# EAGLE design Matrix_SMD (EAGLE 9.1.1)
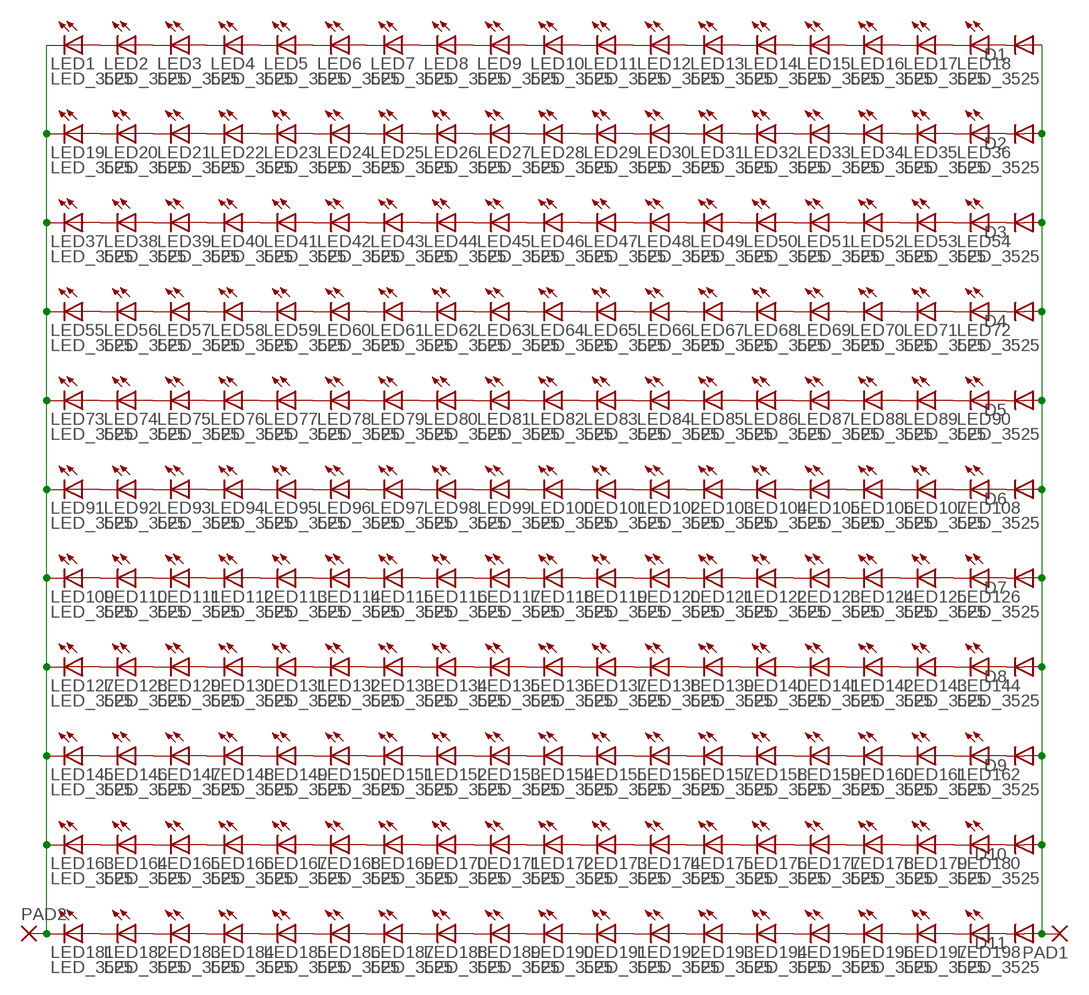
[diagram p0: schematic, sheet 1]

## Parts
D1  DIODE-SOD123  [SOD123]
D2  DIODE-SOD123  [SOD123]
D3  DIODE-SOD123  [SOD123]
D4  DIODE-SOD123  [SOD123]
D5  DIODE-SOD123  [SOD123]
D6  DIODE-SOD123  [SOD123]
D7  DIODE-SOD123  [SOD123]
D8  DIODE-SOD123  [SOD123]
D9  DIODE-SOD123  [SOD123]
D10  DIODE-SOD123  [SOD123]
D11  DIODE-SOD123  [SOD123]
LED1  LED_3525  [LED3528]
LED2  LED_3525  [LED3528]
LED3  LED_3525  [LED3528]
LED4  LED_3525  [LED3528]
LED5  LED_3525  [LED3528]
LED6  LED_3525  [LED3528]
LED7  LED_3525  [LED3528]
LED8  LED_3525  [LED3528]
LED9  LED_3525  [LED3528]
LED10  LED_3525  [LED3528]
LED11  LED_3525  [LED3528]
LED12  LED_3525  [LED3528]
LED13  LED_3525  [LED3528]
LED14  LED_3525  [LED3528]
LED15  LED_3525  [LED3528]
LED16  LED_3525  [LED3528]
LED17  LED_3525  [LED3528]
LED18  LED_3525  [LED3528]
LED19  LED_3525  [LED3528]
LED20  LED_3525  [LED3528]
LED21  LED_3525  [LED3528]
LED22  LED_3525  [LED3528]
LED23  LED_3525  [LED3528]
LED24  LED_3525  [LED3528]
LED25  LED_3525  [LED3528]
LED26  LED_3525  [LED3528]
LED27  LED_3525  [LED3528]
LED28  LED_3525  [LED3528]
LED29  LED_3525  [LED3528]
LED30  LED_3525  [LED3528]
LED31  LED_3525  [LED3528]
LED32  LED_3525  [LED3528]
LED33  LED_3525  [LED3528]
LED34  LED_3525  [LED3528]
LED35  LED_3525  [LED3528]
LED36  LED_3525  [LED3528]
LED37  LED_3525  [LED3528]
LED38  LED_3525  [LED3528]
LED39  LED_3525  [LED3528]
LED40  LED_3525  [LED3528]
LED41  LED_3525  [LED3528]
LED42  LED_3525  [LED3528]
LED43  LED_3525  [LED3528]
LED44  LED_3525  [LED3528]
LED45  LED_3525  [LED3528]
LED46  LED_3525  [LED3528]
LED47  LED_3525  [LED3528]
LED48  LED_3525  [LED3528]
LED49  LED_3525  [LED3528]
LED50  LED_3525  [LED3528]
LED51  LED_3525  [LED3528]
LED52  LED_3525  [LED3528]
LED53  LED_3525  [LED3528]
LED54  LED_3525  [LED3528]
LED55  LED_3525  [LED3528]
LED56  LED_3525  [LED3528]
LED57  LED_3525  [LED3528]
LED58  LED_3525  [LED3528]
LED59  LED_3525  [LED3528]
LED60  LED_3525  [LED3528]
LED61  LED_3525  [LED3528]
LED62  LED_3525  [LED3528]
LED63  LED_3525  [LED3528]
LED64  LED_3525  [LED3528]
LED65  LED_3525  [LED3528]
LED66  LED_3525  [LED3528]
LED67  LED_3525  [LED3528]
LED68  LED_3525  [LED3528]
LED69  LED_3525  [LED3528]
LED70  LED_3525  [LED3528]
LED71  LED_3525  [LED3528]
LED72  LED_3525  [LED3528]
LED73  LED_3525  [LED3528]
LED74  LED_3525  [LED3528]
LED75  LED_3525  [LED3528]
LED76  LED_3525  [LED3528]
LED77  LED_3525  [LED3528]
LED78  LED_3525  [LED3528]
LED79  LED_3525  [LED3528]
LED80  LED_3525  [LED3528]
LED81  LED_3525  [LED3528]
LED82  LED_3525  [LED3528]
LED83  LED_3525  [LED3528]
LED84  LED_3525  [LED3528]
LED85  LED_3525  [LED3528]
LED86  LED_3525  [LED3528]
LED87  LED_3525  [LED3528]
LED88  LED_3525  [LED3528]
LED89  LED_3525  [LED3528]
LED90  LED_3525  [LED3528]
LED91  LED_3525  [LED3528]
LED92  LED_3525  [LED3528]
LED93  LED_3525  [LED3528]
LED94  LED_3525  [LED3528]
LED95  LED_3525  [LED3528]
LED96  LED_3525  [LED3528]
LED97  LED_3525  [LED3528]
LED98  LED_3525  [LED3528]
LED99  LED_3525  [LED3528]
LED100  LED_3525  [LED3528]
LED101  LED_3525  [LED3528]
LED102  LED_3525  [LED3528]
LED103  LED_3525  [LED3528]
LED104  LED_3525  [LED3528]
LED105  LED_3525  [LED3528]
LED106  LED_3525  [LED3528]
LED107  LED_3525  [LED3528]
LED108  LED_3525  [LED3528]
LED109  LED_3525  [LED3528]
LED110  LED_3525  [LED3528]
LED111  LED_3525  [LED3528]
LED112  LED_3525  [LED3528]
LED113  LED_3525  [LED3528]
LED114  LED_3525  [LED3528]
LED115  LED_3525  [LED3528]
LED116  LED_3525  [LED3528]
LED117  LED_3525  [LED3528]
LED118  LED_3525  [LED3528]
LED119  LED_3525  [LED3528]
LED120  LED_3525  [LED3528]
LED121  LED_3525  [LED3528]
LED122  LED_3525  [LED3528]
LED123  LED_3525  [LED3528]
LED124  LED_3525  [LED3528]
LED125  LED_3525  [LED3528]
LED126  LED_3525  [LED3528]
LED127  LED_3525  [LED3528]
LED128  LED_3525  [LED3528]
LED129  LED_3525  [LED3528]
LED130  LED_3525  [LED3528]
LED131  LED_3525  [LED3528]
LED132  LED_3525  [LED3528]
LED133  LED_3525  [LED3528]
LED134  LED_3525  [LED3528]
LED135  LED_3525  [LED3528]
LED136  LED_3525  [LED3528]
LED137  LED_3525  [LED3528]
LED138  LED_3525  [LED3528]
LED139  LED_3525  [LED3528]
LED140  LED_3525  [LED3528]
LED141  LED_3525  [LED3528]
LED142  LED_3525  [LED3528]
LED143  LED_3525  [LED3528]
LED144  LED_3525  [LED3528]
LED145  LED_3525  [LED3528]
LED146  LED_3525  [LED3528]
LED147  LED_3525  [LED3528]
LED148  LED_3525  [LED3528]
LED149  LED_3525  [LED3528]
LED150  LED_3525  [LED3528]
LED151  LED_3525  [LED3528]
LED152  LED_3525  [LED3528]
LED153  LED_3525  [LED3528]
LED154  LED_3525  [LED3528]
LED155  LED_3525  [LED3528]
LED156  LED_3525  [LED3528]
LED157  LED_3525  [LED3528]
LED158  LED_3525  [LED3528]
LED159  LED_3525  [LED3528]
LED160  LED_3525  [LED3528]
LED161  LED_3525  [LED3528]
LED162  LED_3525  [LED3528]
LED163  LED_3525  [LED3528]
LED164  LED_3525  [LED3528]
LED165  LED_3525  [LED3528]
LED166  LED_3525  [LED3528]
LED167  LED_3525  [LED3528]
LED168  LED_3525  [LED3528]
LED169  LED_3525  [LED3528]
LED170  LED_3525  [LED3528]
LED171  LED_3525  [LED3528]
LED172  LED_3525  [LED3528]
LED173  LED_3525  [LED3528]
LED174  LED_3525  [LED3528]
LED175  LED_3525  [LED3528]
LED176  LED_3525  [LED3528]
LED177  LED_3525  [LED3528]
LED178  LED_3525  [LED3528]
LED179  LED_3525  [LED3528]
LED180  LED_3525  [LED3528]
LED181  LED_3525  [LED3528]
LED182  LED_3525  [LED3528]
LED183  LED_3525  [LED3528]
LED184  LED_3525  [LED3528]
LED185  LED_3525  [LED3528]
LED186  LED_3525  [LED3528]
LED187  LED_3525  [LED3528]
LED188  LED_3525  [LED3528]
LED189  LED_3525  [LED3528]
LED190  LED_3525  [LED3528]
LED191  LED_3525  [LED3528]
LED192  LED_3525  [LED3528]
LED193  LED_3525  [LED3528]
LED194  LED_3525  [LED3528]
LED195  LED_3525  [LED3528]
LED196  LED_3525  [LED3528]
LED197  LED_3525  [LED3528]
LED198  LED_3525  [LED3528]
PAD1  3,81/1,4  [3,81/1,4]
PAD2  3,81/1,4  [3,81/1,4]

## Nets
N$1: LED1.A LED2.C
N$2: LED2.A LED3.C
N$3: LED3.A LED4.C
N$4: LED4.A LED5.C
N$5: LED5.A LED6.C
N$6: LED6.A LED7.C
N$7: LED7.A LED8.C
N$8: LED8.A LED9.C
N$9: LED9.A LED10.C
N$10: LED10.A LED11.C
N$11: LED11.A LED12.C
N$12: LED12.A LED13.C
N$13: LED13.A LED14.C
N$14: LED14.A LED15.C
N$15: LED15.A LED16.C
N$16: LED16.A LED17.C
N$17: LED17.A LED18.C
N$18: D1.C LED18.A
N$19: LED19.A LED20.C
N$20: LED20.A LED21.C
N$21: LED21.A LED22.C
N$22: LED22.A LED23.C
N$23: LED23.A LED24.C
N$24: LED24.A LED25.C
N$25: LED25.A LED26.C
N$26: LED26.A LED27.C
N$27: LED27.A LED28.C
N$28: LED28.A LED29.C
N$29: LED29.A LED30.C
N$30: LED30.A LED31.C
N$31: LED31.A LED32.C
N$32: LED32.A LED33.C
N$33: LED33.A LED34.C
N$34: LED34.A LED35.C
N$35: LED35.A LED36.C
N$36: D2.C LED36.A
N$37: LED37.A LED38.C
N$38: LED38.A LED39.C
N$39: LED39.A LED40.C
N$40: LED40.A LED41.C
N$41: LED41.A LED42.C
N$42: LED42.A LED43.C
N$43: LED43.A LED44.C
N$44: LED44.A LED45.C
N$45: LED45.A LED46.C
N$46: LED46.A LED47.C
N$47: LED47.A LED48.C
N$48: LED48.A LED49.C
N$49: LED49.A LED50.C
N$50: LED50.A LED51.C
N$51: LED51.A LED52.C
N$52: LED52.A LED53.C
N$53: LED53.A LED54.C
N$54: D3.C LED54.A
N$55: LED55.A LED56.C
N$56: LED56.A LED57.C
N$57: LED57.A LED58.C
N$58: LED58.A LED59.C
N$59: LED59.A LED60.C
N$60: LED60.A LED61.C
N$61: LED61.A LED62.C
N$62: LED62.A LED63.C
N$63: LED63.A LED64.C
N$64: LED64.A LED65.C
N$65: LED65.A LED66.C
N$66: LED66.A LED67.C
N$67: LED67.A LED68.C
N$68: LED68.A LED69.C
N$69: LED69.A LED70.C
N$70: LED70.A LED71.C
N$71: LED71.A LED72.C
N$72: D4.C LED72.A
N$73: LED73.A LED74.C
N$74: LED74.A LED75.C
N$75: LED75.A LED76.C
N$76: LED76.A LED77.C
N$77: LED77.A LED78.C
N$78: LED78.A LED79.C
N$79: LED79.A LED80.C
N$80: LED80.A LED81.C
N$81: LED81.A LED82.C
N$82: LED82.A LED83.C
N$83: LED83.A LED84.C
N$84: LED84.A LED85.C
N$85: LED85.A LED86.C
N$86: LED86.A LED87.C
N$87: LED87.A LED88.C
N$88: LED88.A LED89.C
N$89: LED89.A LED90.C
N$90: D5.C LED90.A
N$91: LED91.A LED92.C
N$92: LED92.A LED93.C
N$93: LED93.A LED94.C
N$94: LED94.A LED95.C
N$95: LED95.A LED96.C
N$96: LED96.A LED97.C
N$97: LED97.A LED98.C
N$98: LED98.A LED99.C
N$99: LED99.A LED100.C
N$100: LED100.A LED101.C
N$101: LED101.A LED102.C
N$102: LED102.A LED103.C
N$103: LED103.A LED104.C
N$104: LED104.A LED105.C
N$105: LED105.A LED106.C
N$106: LED106.A LED107.C
N$107: LED107.A LED108.C
N$108: D6.C LED108.A
N$109: LED109.A LED110.C
N$110: LED110.A LED111.C
N$111: LED111.A LED112.C
N$112: LED112.A LED113.C
N$113: LED113.A LED114.C
N$114: LED114.A LED115.C
N$115: LED115.A LED116.C
N$116: LED116.A LED117.C
N$117: LED117.A LED118.C
N$118: LED118.A LED119.C
N$119: LED119.A LED120.C
N$120: LED120.A LED121.C
N$121: LED121.A LED122.C
N$122: LED122.A LED123.C
N$123: LED123.A LED124.C
N$124: LED124.A LED125.C
N$125: LED125.A LED126.C
N$126: D7.C LED126.A
N$127: LED127.A LED128.C
N$128: LED128.A LED129.C
N$129: LED129.A LED130.C
N$130: LED130.A LED131.C
N$131: LED131.A LED132.C
N$132: LED132.A LED133.C
N$133: LED133.A LED134.C
N$134: LED134.A LED135.C
N$135: LED135.A LED136.C
N$136: LED136.A LED137.C
N$137: LED137.A LED138.C
N$138: LED138.A LED139.C
N$139: LED139.A LED140.C
N$140: LED140.A LED141.C
N$141: LED141.A LED142.C
N$142: LED142.A LED143.C
N$143: LED143.A LED144.C
N$144: D8.C LED144.A
N$145: LED145.A LED146.C
N$146: LED146.A LED147.C
N$147: LED147.A LED148.C
N$148: LED148.A LED149.C
N$149: LED149.A LED150.C
N$150: LED150.A LED151.C
N$151: LED151.A LED152.C
N$152: LED152.A LED153.C
N$153: LED153.A LED154.C
N$154: LED154.A LED155.C
N$155: LED155.A LED156.C
N$156: LED156.A LED157.C
N$157: LED157.A LED158.C
N$158: LED158.A LED159.C
N$159: LED159.A LED160.C
N$160: LED160.A LED161.C
N$161: LED161.A LED162.C
N$162: D9.C LED162.A
N$163: LED163.A LED164.C
N$164: LED164.A LED165.C
N$165: LED165.A LED166.C
N$166: LED166.A LED167.C
N$167: LED167.A LED168.C
N$168: LED168.A LED169.C
N$169: LED169.A LED170.C
N$170: LED170.A LED171.C
N$171: LED171.A LED172.C
N$172: LED172.A LED173.C
N$173: LED173.A LED174.C
N$174: LED174.A LED175.C
N$175: LED175.A LED176.C
N$176: LED176.A LED177.C
N$177: LED177.A LED178.C
N$178: LED178.A LED179.C
N$179: LED179.A LED180.C
N$180: D10.C LED180.A
N$181: LED181.A LED182.C
N$182: LED182.A LED183.C
N$183: LED183.A LED184.C
N$184: LED184.A LED185.C
N$185: LED185.A LED186.C
N$186: LED186.A LED187.C
N$187: LED187.A LED188.C
N$188: LED188.A LED189.C
N$189: LED189.A LED190.C
N$190: LED190.A LED191.C
N$191: LED191.A LED192.C
N$192: LED192.A LED193.C
N$193: LED193.A LED194.C
N$194: LED194.A LED195.C
N$195: LED195.A LED196.C
N$196: LED196.A LED197.C
N$197: LED197.A LED198.C
N$198: D11.C LED198.A
N$199: LED1.C LED19.C LED37.C LED55.C LED73.C LED91.C LED109.C LED127.C LED145.C LED163.C LED181.C PAD2.1(P)
N$200: D1.A D2.A D3.A D4.A D5.A D6.A D7.A D8.A D9.A D10.A D11.A PAD1.1(P)

## Library data of the parts
D1-D11 = diode:DIODE-: DIODE
LED1-LED198 = Flamberm:LED_
PAD1 PAD2 = wirepad:3,81/1,4: THROUGH-HOLE PAD

## Board
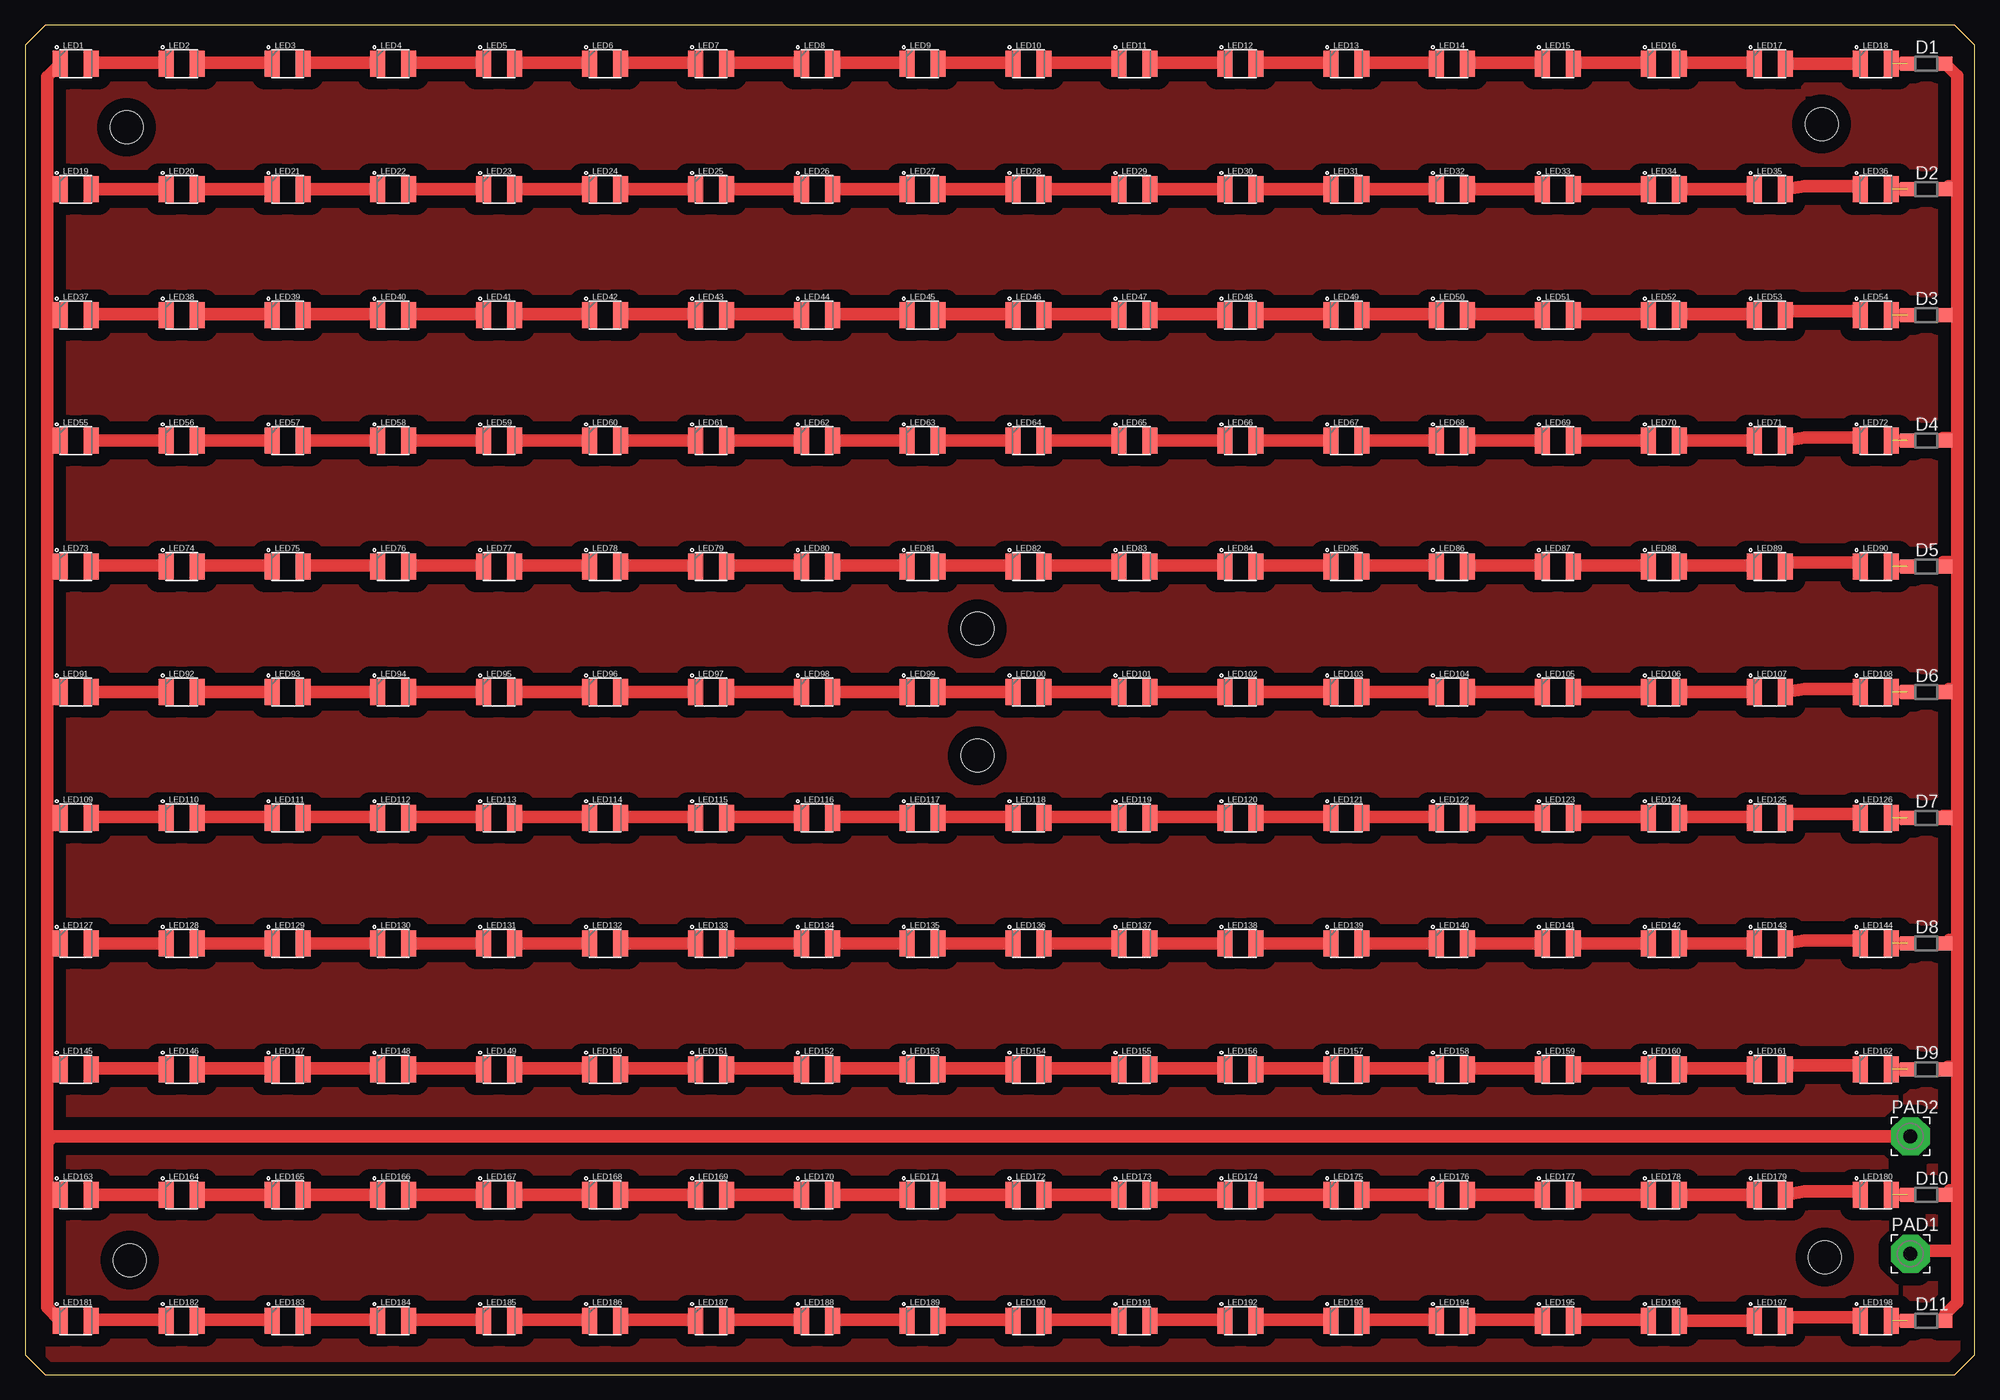
[diagram p1: board, top side]

Size 195 x 135 mm. Coordinates in mm from the lower left corner, seen from the top.
Outline: 2,0 193,0 195,2 195,133 193,135 2,135 0,133 0,2 2,0
Copper layers (1*16): Top 0.035mm / dielectric 1.5mm / Bottom 0.035mm
Design rules "default": minimum track width 6mil, minimum drill 0.35mm, track to track 6mil, track to pad 6mil, pad to pad 6mil, via to via 6mil, smd to smd 6mil, copper to edge 40mil, drill to drill 6mil, minimum pad ring 10mil, minimum via ring 8mil, stop-mask expansion 4mil, vias tented up to drill 0mil, thermal gap 10mil
Holes 3.3 mm at 10.48,11.43 10.16,124.78 180.02,11.75 179.71,125.09 95.25,61.91 95.25,74.61

### Footprints (pad centres in the part's own frame; a part is rotated, then mirrored left to right if it is on the bottom)
SOD123 = smd 1.4 x 1.4: A 1.9,0; C -1.9,0
LED3528 = smd 1.5 x 2.6: A 1.55,0; C -1.55,0
3,81/1,4 = drill 1.397 pad 3.81 octagon: 1 0,0

### Placement (x,y rotation side)
D1  190.18,131.13 0 top
D2  190.18,118.55 0 top
D3  190.18,105.98 0 top
D4  190.18,93.41 0 top
D5  190.18,80.84 0 top
D6  190.18,68.26 0 top
D7  190.18,55.69 0 top
D8  190.18,43.12 0 top
D9  190.18,30.54 0 top
D10  190.18,17.97 0 top
D11  190.18,5.4 0 top
LED1  5.08,131.13 0 top
LED2  15.67,131.13 0 top
LED3  26.26,131.13 0 top
LED4  36.85,131.13 0 top
LED5  47.44,131.13 0 top
LED6  58.03,131.13 0 top
LED7  68.62,131.13 0 top
LED8  79.21,131.13 0 top
LED9  89.8,131.13 0 top
LED10  100.39,131.13 0 top
LED11  110.98,131.13 0 top
LED12  121.57,131.13 0 top
LED13  132.15,131.13 0 top
LED14  142.74,131.13 0 top
LED15  153.33,131.13 0 top
LED16  163.92,131.13 0 top
LED17  174.51,131.13 0 top
LED18  185.1,131.13 0 top
LED19  5.08,118.55 0 top
LED20  15.67,118.55 0 top
LED21  26.26,118.55 0 top
LED22  36.85,118.55 0 top
LED23  47.44,118.55 0 top
LED24  58.03,118.55 0 top
LED25  68.62,118.55 0 top
LED26  79.21,118.55 0 top
LED27  89.8,118.55 0 top
LED28  100.39,118.55 0 top
LED29  110.98,118.55 0 top
LED30  121.57,118.55 0 top
LED31  132.15,118.55 0 top
LED32  142.74,118.55 0 top
LED33  153.33,118.55 0 top
LED34  163.92,118.55 0 top
LED35  174.51,118.55 0 top
LED36  185.1,118.55 0 top
LED37  5.08,105.98 0 top
LED38  15.67,105.98 0 top
LED39  26.26,105.98 0 top
LED40  36.85,105.98 0 top
LED41  47.44,105.98 0 top
LED42  58.03,105.98 0 top
LED43  68.62,105.98 0 top
LED44  79.21,105.98 0 top
LED45  89.8,105.98 0 top
LED46  100.39,105.98 0 top
LED47  110.98,105.98 0 top
LED48  121.57,105.98 0 top
LED49  132.15,105.98 0 top
LED50  142.74,105.98 0 top
LED51  153.33,105.98 0 top
LED52  163.92,105.98 0 top
LED53  174.51,105.98 0 top
LED54  185.1,105.98 0 top
LED55  5.08,93.41 0 top
LED56  15.67,93.41 0 top
LED57  26.26,93.41 0 top
LED58  36.85,93.41 0 top
LED59  47.44,93.41 0 top
LED60  58.03,93.41 0 top
LED61  68.62,93.41 0 top
LED62  79.21,93.41 0 top
LED63  89.8,93.41 0 top
LED64  100.39,93.41 0 top
LED65  110.98,93.41 0 top
LED66  121.57,93.41 0 top
LED67  132.15,93.41 0 top
LED68  142.74,93.41 0 top
LED69  153.33,93.41 0 top
LED70  163.92,93.41 0 top
LED71  174.51,93.41 0 top
LED72  185.1,93.41 0 top
LED73  5.08,80.84 0 top
LED74  15.67,80.84 0 top
LED75  26.26,80.84 0 top
LED76  36.85,80.84 0 top
LED77  47.44,80.84 0 top
LED78  58.03,80.84 0 top
LED79  68.62,80.84 0 top
LED80  79.21,80.84 0 top
LED81  89.8,80.84 0 top
LED82  100.39,80.84 0 top
LED83  110.98,80.84 0 top
LED84  121.57,80.84 0 top
LED85  132.15,80.84 0 top
LED86  142.74,80.84 0 top
LED87  153.33,80.84 0 top
LED88  163.92,80.84 0 top
LED89  174.51,80.84 0 top
LED90  185.1,80.84 0 top
LED91  5.08,68.26 0 top
LED92  15.67,68.26 0 top
LED93  26.26,68.26 0 top
LED94  36.85,68.26 0 top
LED95  47.44,68.26 0 top
LED96  58.03,68.26 0 top
LED97  68.62,68.26 0 top
LED98  79.21,68.26 0 top
LED99  89.8,68.26 0 top
LED100  100.39,68.26 0 top
LED101  110.98,68.26 0 top
LED102  121.57,68.26 0 top
LED103  132.15,68.26 0 top
LED104  142.74,68.26 0 top
LED105  153.33,68.26 0 top
LED106  163.92,68.26 0 top
LED107  174.51,68.26 0 top
LED108  185.1,68.26 0 top
LED109  5.08,55.69 0 top
LED110  15.67,55.69 0 top
LED111  26.26,55.69 0 top
LED112  36.85,55.69 0 top
LED113  47.44,55.69 0 top
LED114  58.03,55.69 0 top
LED115  68.62,55.69 0 top
LED116  79.21,55.69 0 top
LED117  89.8,55.69 0 top
LED118  100.39,55.69 0 top
LED119  110.98,55.69 0 top
LED120  121.57,55.69 0 top
LED121  132.15,55.69 0 top
LED122  142.74,55.69 0 top
LED123  153.33,55.69 0 top
LED124  163.92,55.69 0 top
LED125  174.51,55.69 0 top
LED126  185.1,55.69 0 top
LED127  5.08,43.12 0 top
LED128  15.67,43.12 0 top
LED129  26.26,43.12 0 top
LED130  36.85,43.12 0 top
LED131  47.44,43.12 0 top
LED132  58.03,43.12 0 top
LED133  68.62,43.12 0 top
LED134  79.21,43.12 0 top
LED135  89.8,43.12 0 top
LED136  100.39,43.12 0 top
LED137  110.98,43.12 0 top
LED138  121.57,43.12 0 top
LED139  132.15,43.12 0 top
LED140  142.74,43.12 0 top
LED141  153.33,43.12 0 top
LED142  163.92,43.12 0 top
LED143  174.51,43.12 0 top
LED144  185.1,43.12 0 top
LED145  5.08,30.54 0 top
LED146  15.67,30.54 0 top
LED147  26.26,30.54 0 top
LED148  36.85,30.54 0 top
LED149  47.44,30.54 0 top
LED150  58.03,30.54 0 top
LED151  68.62,30.54 0 top
LED152  79.21,30.54 0 top
LED153  89.8,30.54 0 top
LED154  100.39,30.54 0 top
LED155  110.98,30.54 0 top
LED156  121.57,30.54 0 top
LED157  132.15,30.54 0 top
LED158  142.74,30.54 0 top
LED159  153.33,30.54 0 top
LED160  163.92,30.54 0 top
LED161  174.51,30.54 0 top
LED162  185.1,30.54 0 top
LED163  5.08,17.97 0 top
LED164  15.67,17.97 0 top
LED165  26.26,17.97 0 top
LED166  36.85,17.97 0 top
LED167  47.44,17.97 0 top
LED168  58.03,17.97 0 top
LED169  68.62,17.97 0 top
LED170  79.21,17.97 0 top
LED171  89.8,17.97 0 top
LED172  100.39,17.97 0 top
LED173  110.98,17.97 0 top
LED174  121.57,17.97 0 top
LED175  132.15,17.97 0 top
LED176  142.74,17.97 0 top
LED177  153.33,17.97 0 top
LED178  163.92,17.97 0 top
LED179  174.51,17.97 0 top
LED180  185.1,17.97 0 top
LED181  5.08,5.4 0 top
LED182  15.67,5.4 0 top
LED183  26.26,5.4 0 top
LED184  36.85,5.4 0 top
LED185  47.44,5.4 0 top
LED186  58.03,5.4 0 top
LED187  68.62,5.4 0 top
LED188  79.21,5.4 0 top
LED189  89.8,5.4 0 top
LED190  100.39,5.4 0 top
LED191  110.98,5.4 0 top
LED192  121.57,5.4 0 top
LED193  132.15,5.4 0 top
LED194  142.74,5.4 0 top
LED195  153.33,5.4 0 top
LED196  163.92,5.4 0 top
LED197  174.51,5.4 0 top
LED198  185.1,5.4 0 top
PAD1  188.59,12.06 0 top
PAD2  188.59,23.81 0 top

### Tracks (layer width: path | path; a pad name or v marks a point on that pad's centre or on a via)
N$1
  Top 1.27: LED1.A 6.71,131.22 14.1,131.22 LED2.C
N$2
  Top 1.27: LED2.A 17.3,131.22 24.68,131.22 LED3.C
N$3
  Top 1.27: LED3.A 27.89,131.22 35.27,131.22 LED4.C
N$4
  Top 1.27: LED4.A 38.47,131.22 45.86,131.22 LED5.C
N$5
  Top 1.27: LED5.A 49.06,131.22 56.45,131.22 LED6.C
N$6
  Top 1.27: LED6.A 59.65,131.22 67.04,131.22 LED7.C
N$7
  Top 1.27: LED7.A 70.24,131.22 77.63,131.22 LED8.C
N$8
  Top 1.27: LED8.A 80.83,131.22 88.22,131.22 LED9.C
N$9
  Top 1.27: LED9.A 91.42,131.22 98.81,131.22 LED10.C
N$10
  Top 1.27: LED10.A 102.01,131.22 109.4,131.22 LED11.C
N$11
  Top 1.27: LED11.A 112.6,131.22 119.99,131.22 LED12.C
N$12
  Top 1.27: LED12.A 123.19,131.22 130.58,131.22 LED13.C
N$13
  Top 1.27: LED13.A 133.78,131.22 141.17,131.22 LED14.C
N$14
  Top 1.27: LED14.A 144.37,131.22 151.76,131.22 LED15.C
N$15
  Top 1.27: LED15.A 154.96,131.22 162.35,131.22 LED16.C
N$16
  Top 1.27: LED16.A 165.55,131.22 172.94,131.22 LED17.C
N$17
  Top 1.27: LED18.C LED17.A
N$18  (1 unrouted)
  Top 1.27: D1.C LED18.A
N$19
  Top 1.27: LED19.A 6.71,118.57 14.1,118.57 LED20.C
N$20
  Top 1.27: LED20.A 17.3,118.57 24.68,118.57 LED21.C
N$21
  Top 1.27: LED21.A 27.89,118.57 35.27,118.57 LED22.C
N$22
  Top 1.27: LED22.A 38.47,118.57 45.86,118.57 LED23.C
N$23
  Top 1.27: LED23.A 49.06,118.57 56.45,118.57 LED24.C
N$24
  Top 1.27: LED24.A 59.65,118.57 67.04,118.57 LED25.C
N$25
  Top 1.27: LED25.A 70.24,118.57 77.63,118.57 LED26.C
N$26
  Top 1.27: LED26.A 80.83,118.57 88.22,118.57 LED27.C
N$27
  Top 1.27: LED27.A 91.42,118.57 98.81,118.57 LED28.C
N$28
  Top 1.27: LED28.A 102.01,118.57 109.4,118.57 LED29.C
N$29
  Top 1.27: LED29.A 112.6,118.57 119.99,118.57 LED30.C
N$30
  Top 1.27: LED30.A 123.19,118.57 130.58,118.57 LED31.C
N$31
  Top 1.27: LED31.A 133.78,118.57 141.17,118.57 LED32.C
N$32
  Top 1.27: LED32.A 144.37,118.57 151.76,118.57 LED33.C
N$33
  Top 1.27: LED34.C LED33.A
N$34
  Top 1.27: LED34.A 165.55,118.57 172.94,118.57 LED35.C
N$35
  Top 1.27: LED35.A 178.03,118.89 182.91,118.89 LED36.C
N$36  (1 unrouted)
  Top 1.27: D2.C LED36.A
N$37
  Top 1.27: LED37.A 6.71,106.07 14.1,106.07 LED38.C
N$38
  Top 1.27: LED38.A 17.3,106.07 24.68,106.07 LED39.C
N$39
  Top 1.27: LED39.A 27.89,106.07 35.27,106.07 LED40.C
N$40
  Top 1.27: LED40.A 38.47,106.07 45.86,106.07 LED41.C
N$41
  Top 1.27: LED41.A 49.06,106.07 56.45,106.07 LED42.C
N$42
  Top 1.27: LED42.A 59.65,106.07 67.04,106.07 LED43.C
N$43
  Top 1.27: LED43.A 70.24,106.07 77.63,106.07 LED44.C
N$44
  Top 1.27: LED44.A 80.83,106.07 88.22,106.07 LED45.C
N$45
  Top 1.27: LED45.A 91.42,106.07 98.81,106.07 LED46.C
N$46
  Top 1.27: LED46.A 102.01,106.07 109.4,106.07 LED47.C
N$47
  Top 1.27: LED47.A 112.6,106.07 119.99,106.07 LED48.C
N$48
  Top 1.27: LED48.A 123.19,106.07 130.58,106.07 LED49.C
N$49
  Top 1.27: LED49.A 133.78,106.07 141.17,106.07 LED50.C
N$50
  Top 1.27: LED50.A 144.37,106.07 151.76,106.07 LED51.C
N$51
  Top 1.27: LED51.A 154.96,106.07 162.35,106.07 LED52.C
N$52
  Top 1.27: LED52.A 165.55,106.07 172.94,106.07 LED53.C
N$53
  Top 1.27: LED53.A 176.41,106.39 183.44,106.39 LED54.C
N$54  (1 unrouted)
  Top 1.27: D3.C LED54.A
N$55
  Top 1.27: LED55.A 6.71,93.42 14.1,93.42 LED56.C
N$56
  Top 1.27: LED56.A 17.3,93.42 24.68,93.42 LED57.C
N$57
  Top 1.27: LED57.A 27.89,93.42 35.27,93.42 LED58.C
N$58
  Top 1.27: LED58.A 38.47,93.42 45.86,93.42 LED59.C
N$59
  Top 1.27: LED59.A 49.06,93.42 56.45,93.42 LED60.C
N$60
  Top 1.27: LED60.A 59.65,93.42 67.04,93.42 LED61.C
N$61
  Top 1.27: LED61.A 70.24,93.42 77.63,93.42 LED62.C
N$62
  Top 1.27: LED62.A 80.83,93.42 88.22,93.42 LED63.C
N$63
  Top 1.27: LED63.A 91.42,93.42 98.81,93.42 LED64.C
N$64
  Top 1.27: LED64.A 102.01,93.42 109.4,93.42 LED65.C
N$65
  Top 1.27: LED65.A 112.6,93.42 119.99,93.42 LED66.C
N$66
  Top 1.27: LED66.A 123.19,93.42 130.58,93.42 LED67.C
N$67
  Top 1.27: LED67.A 133.78,93.42 141.17,93.42 LED68.C
N$68
  Top 1.27: LED68.A 144.37,93.42 151.76,93.42 LED69.C
N$69
  Top 1.27: LED70.C LED69.A
N$70
  Top 1.27: LED70.A 165.55,93.42 172.94,93.42 LED71.C
N$71
  Top 1.27: LED71.A 178.03,93.74 182.91,93.74 LED72.C
N$72  (1 unrouted)
  Top 1.27: D4.C LED72.A
N$73
  Top 1.27: LED73.A 6.71,80.92 14.1,80.92 LED74.C
N$74
  Top 1.27: LED74.A 17.3,80.92 24.68,80.92 LED75.C
N$75
  Top 1.27: LED75.A 27.89,80.92 35.27,80.92 LED76.C
N$76
  Top 1.27: LED76.A 38.47,80.92 45.86,80.92 LED77.C
N$77
  Top 1.27: LED77.A 49.06,80.92 56.45,80.92 LED78.C
N$78
  Top 1.27: LED78.A 59.65,80.92 67.04,80.92 LED79.C
N$79
  Top 1.27: LED79.A 70.24,80.92 77.63,80.92 LED80.C
N$80
  Top 1.27: LED80.A 80.83,80.92 88.22,80.92 LED81.C
N$81
  Top 1.27: LED81.A 91.42,80.92 98.81,80.92 LED82.C
N$82
  Top 1.27: LED82.A 102.01,80.92 109.4,80.92 LED83.C
N$83
  Top 1.27: LED83.A 112.6,80.92 119.99,80.92 LED84.C
N$84
  Top 1.27: LED84.A 123.19,80.92 130.58,80.92 LED85.C
N$85
  Top 1.27: LED85.A 133.78,80.92 141.17,80.92 LED86.C
N$86
  Top 1.27: LED86.A 144.37,80.92 151.76,80.92 LED87.C
N$87
  Top 1.27: LED87.A 154.96,80.92 162.35,80.92 LED88.C
N$88
  Top 1.27: LED88.A 165.55,80.92 172.94,80.92 LED89.C
N$89
  Top 1.27: LED89.A 176.41,81.24 183.44,81.24 LED90.C
N$90  (1 unrouted)
  Top 1.27: D5.C LED90.A
N$91
  Top 1.27: LED91.A 6.71,68.28 14.1,68.28 LED92.C
N$92
  Top 1.27: LED92.A 17.3,68.28 24.68,68.28 LED93.C
N$93
  Top 1.27: LED93.A 27.89,68.28 35.27,68.28 LED94.C
N$94
  Top 1.27: LED94.A 38.47,68.28 45.86,68.28 LED95.C
N$95
  Top 1.27: LED95.A 49.06,68.28 56.45,68.28 LED96.C
N$96
  Top 1.27: LED96.A 59.65,68.28 67.04,68.28 LED97.C
N$97
  Top 1.27: LED97.A 70.24,68.28 77.63,68.28 LED98.C
N$98
  Top 1.27: LED98.A 80.83,68.28 88.22,68.28 LED99.C
N$99
  Top 1.27: LED99.A 91.42,68.28 98.81,68.28 LED100.C
N$100
  Top 1.27: LED100.A 102.01,68.28 109.4,68.28 LED101.C
N$101
  Top 1.27: LED101.A 112.6,68.28 119.99,68.28 LED102.C
N$102
  Top 1.27: LED102.A 123.19,68.28 130.58,68.28 LED103.C
N$103
  Top 1.27: LED103.A 133.78,68.28 141.17,68.28 LED104.C
N$104
  Top 1.27: LED104.A 144.37,68.28 151.76,68.28 LED105.C
N$105
  Top 1.27: LED106.C LED105.A
N$106
  Top 1.27: LED106.A 165.55,68.28 172.94,68.28 LED107.C
N$107
  Top 1.27: LED107.A 178.03,68.59 182.91,68.59 LED108.C
N$108  (1 unrouted)
  Top 1.27: D6.C LED108.A
N$109
  Top 1.27: LED109.A 6.71,55.78 14.1,55.78 LED110.C
N$110
  Top 1.27: LED110.A 17.3,55.78 24.68,55.78 LED111.C
N$111
  Top 1.27: LED111.A 27.89,55.78 35.27,55.78 LED112.C
N$112
  Top 1.27: LED112.A 38.47,55.78 45.86,55.78 LED113.C
N$113
  Top 1.27: LED113.A 49.06,55.78 56.45,55.78 LED114.C
N$114
  Top 1.27: LED114.A 59.65,55.78 67.04,55.78 LED115.C
N$115
  Top 1.27: LED115.A 70.24,55.78 77.63,55.78 LED116.C
N$116
  Top 1.27: LED116.A 80.83,55.78 88.22,55.78 LED117.C
N$117
  Top 1.27: LED117.A 91.42,55.78 98.81,55.78 LED118.C
N$118
  Top 1.27: LED118.A 102.01,55.78 109.4,55.78 LED119.C
N$119
  Top 1.27: LED119.A 112.6,55.78 119.99,55.78 LED120.C
N$120
  Top 1.27: LED120.A 123.19,55.78 130.58,55.78 LED121.C
N$121
  Top 1.27: LED121.A 133.78,55.78 141.17,55.78 LED122.C
N$122
  Top 1.27: LED122.A 144.37,55.78 151.76,55.78 LED123.C
N$123
  Top 1.27: LED123.A 154.96,55.78 162.35,55.78 LED124.C
N$124
  Top 1.27: LED124.A 165.55,55.78 172.94,55.78 LED125.C
N$125
  Top 1.27: LED125.A 176.41,56.1 183.44,56.1 LED126.C
N$126  (1 unrouted)
  Top 1.27: D7.C LED126.A
N$127
  Top 1.27: LED127.A 6.71,43.13 14.1,43.13 LED128.C
N$128
  Top 1.27: LED128.A 17.3,43.13 24.68,43.13 LED129.C
N$129
  Top 1.27: LED129.A 27.89,43.13 35.27,43.13 LED130.C
N$130
  Top 1.27: LED130.A 38.47,43.13 45.86,43.13 LED131.C
N$131
  Top 1.27: LED131.A 49.06,43.13 56.45,43.13 LED132.C
N$132
  Top 1.27: LED132.A 59.65,43.13 67.04,43.13 LED133.C
N$133
  Top 1.27: LED133.A 70.24,43.13 77.63,43.13 LED134.C
N$134
  Top 1.27: LED134.A 80.83,43.13 88.22,43.13 LED135.C
N$135
  Top 1.27: LED135.A 91.42,43.13 98.81,43.13 LED136.C
N$136
  Top 1.27: LED136.A 102.01,43.13 109.4,43.13 LED137.C
N$137
  Top 1.27: LED137.A 112.6,43.13 119.99,43.13 LED138.C
N$138
  Top 1.27: LED138.A 123.19,43.13 130.58,43.13 LED139.C
N$139
  Top 1.27: LED139.A 133.78,43.13 141.17,43.13 LED140.C
N$140
  Top 1.27: LED140.A 144.37,43.13 151.76,43.13 LED141.C
N$141
  Top 1.27: LED142.C LED141.A
N$142
  Top 1.27: LED142.A 165.55,43.13 172.94,43.13 LED143.C
N$143
  Top 1.27: LED143.A 178.03,43.45 182.91,43.45 LED144.C
N$144  (1 unrouted)
  Top 1.27: D8.C LED144.A
N$145
  Top 1.27: LED145.A 6.71,30.63 14.1,30.63 LED146.C
N$146
  Top 1.27: LED146.A 17.3,30.63 24.68,30.63 LED147.C
N$147
  Top 1.27: LED147.A 27.89,30.63 35.27,30.63 LED148.C
N$148
  Top 1.27: LED148.A 38.47,30.63 45.86,30.63 LED149.C
N$149
  Top 1.27: LED149.A 49.06,30.63 56.45,30.63 LED150.C
N$150
  Top 1.27: LED150.A 59.65,30.63 67.04,30.63 LED151.C
N$151
  Top 1.27: LED151.A 70.24,30.63 77.63,30.63 LED152.C
N$152
  Top 1.27: LED152.A 80.83,30.63 88.22,30.63 LED153.C
N$153
  Top 1.27: LED153.A 91.42,30.63 98.81,30.63 LED154.C
N$154
  Top 1.27: LED154.A 102.01,30.63 109.4,30.63 LED155.C
N$155
  Top 1.27: LED155.A 112.6,30.63 119.99,30.63 LED156.C
N$156
  Top 1.27: LED156.A 123.19,30.63 130.58,30.63 LED157.C
N$157
  Top 1.27: LED157.A 133.78,30.63 141.17,30.63 LED158.C
N$158
  Top 1.27: LED158.A 144.37,30.63 151.76,30.63 LED159.C
N$159
  Top 1.27: LED159.A 154.96,30.63 162.35,30.63 LED160.C
N$160
  Top 1.27: LED160.A 165.55,30.63 172.94,30.63 LED161.C
N$161
  Top 1.27: LED161.A 176.41,30.95 183.44,30.95 LED162.C
N$162  (1 unrouted)
  Top 1.27: D9.C LED162.A
N$163
  Top 1.27: LED163.A 6.71,17.98 14.1,17.98 LED164.C
N$164
  Top 1.27: LED164.A 17.3,17.98 24.68,17.98 LED165.C
N$165
  Top 1.27: LED165.A 27.89,17.98 35.27,17.98 LED166.C
N$166
  Top 1.27: LED166.A 38.47,17.98 45.86,17.98 LED167.C
N$167
  Top 1.27: LED167.A 49.06,17.98 56.45,17.98 LED168.C
N$168
  Top 1.27: LED168.A 59.65,17.98 67.04,17.98 LED169.C
N$169
  Top 1.27: LED169.A 70.24,17.98 77.63,17.98 LED170.C
N$170
  Top 1.27: LED170.A 80.83,17.98 88.22,17.98 LED171.C
N$171
  Top 1.27: LED171.A 91.42,17.98 98.81,17.98 LED172.C
N$172
  Top 1.27: LED172.A 102.01,17.98 109.4,17.98 LED173.C
N$173
  Top 1.27: LED173.A 112.6,17.98 119.99,17.98 LED174.C
N$174
  Top 1.27: LED174.A 123.19,17.98 130.58,17.98 LED175.C
N$175
  Top 1.27: LED175.A 133.78,17.98 141.17,17.98 LED176.C
N$176
  Top 1.27: LED176.A 144.37,17.98 151.76,17.98 LED177.C
N$177
  Top 1.27: LED178.C LED177.A
N$178
  Top 1.27: LED178.A 165.55,17.98 172.94,17.98 LED179.C
N$179
  Top 1.27: LED179.A 178.03,18.3 182.91,18.3 LED180.C
N$180  (1 unrouted)
  Top 1.27: D10.C LED180.A
N$181
  Top 1.27: LED181.A 6.71,5.49 14.1,5.49 LED182.C
N$182
  Top 1.27: LED182.A 17.3,5.49 24.68,5.49 LED183.C
N$183
  Top 1.27: LED183.A 27.89,5.49 35.27,5.49 LED184.C
N$184
  Top 1.27: LED184.A 38.47,5.49 45.86,5.49 LED185.C
N$185
  Top 1.27: LED185.A 49.06,5.49 56.45,5.49 LED186.C
N$186
  Top 1.27: LED186.A 59.65,5.49 67.04,5.49 LED187.C
N$187
  Top 1.27: LED187.A 70.24,5.49 77.63,5.49 LED188.C
N$188
  Top 1.27: LED188.A 80.83,5.49 88.22,5.49 LED189.C
N$189
  Top 1.27: LED189.A 91.42,5.49 98.81,5.49 LED190.C
N$190
  Top 1.27: LED190.A 102.01,5.49 109.4,5.49 LED191.C
N$191
  Top 1.27: LED191.A 112.6,5.49 119.99,5.49 LED192.C
N$192
  Top 1.27: LED192.A 123.19,5.49 130.58,5.49 LED193.C
N$193
  Top 1.27: LED193.A 133.78,5.49 141.17,5.49 LED194.C
N$194
  Top 1.27: LED194.A 144.37,5.49 151.76,5.49 LED195.C
N$195
  Top 1.27: LED195.A 154.96,5.49 162.35,5.49 LED196.C
N$196
  Top 1.27: LED197.C LED196.A
N$197
  Top 1.27: LED198.C 183.24,5.71 176.38,5.71 LED197.A
N$198  (1 unrouted)
  Top 1.27: D11.C LED198.A
N$199
  Top 1.27: LED181.C 2.22,6.71 2.22,18.1 | LED1.C 2.22,129.82 2.22,118.75 | 2.22,18.1 2.22,23.18 | 2.22,23.18 2.22,30.48 | 2.22,30.48 2.22,42.86 | 2.22,42.86 2.22,55.56 | 2.22,55.56 2.22,68.26 | 2.22,68.26 2.22,80.96 | 2.22,80.96 2.22,93.34 | 2.22,93.34 2.22,106.05 | 2.22,106.05 2.22,118.75 | LED19.C 2.41,118.56 2.22,118.75 | LED37.C 2.29,105.98 2.22,106.05 | LED55.C 3.47,93.34 2.22,93.34 | LED73.C 3.4,80.96 2.22,80.96 | LED91.C 2.22,68.26 | LED109.C 2.35,55.69 2.22,55.56 | LED127.C 2.48,43.12 2.22,42.86 | LED145.C 2.29,30.54 2.22,30.48 | LED163.C 2.35,17.97 2.22,18.1 | PAD2.1 2.86,23.81 2.22,23.18
N$200
  Top 1.27: D1.A 193.27,129.94 193.27,118.75 | 193.27,12.38 193.27,18.41 | 193.27,18.41 193.27,30.8 | 193.27,30.8 193.27,43.5 | 193.27,43.5 193.27,55.88 | 193.27,55.88 193.27,68.58 | 193.27,68.58 193.27,81.28 | 193.27,81.28 193.27,93.66 | 193.27,93.66 193.27,106.05 | 193.27,106.05 193.27,118.75 | 193.27,118.75 193.15,118.87 192.4,118.87 D2.A | D3.A 192.02,106.05 193.27,106.05 | D4.A 191.83,93.66 193.27,93.66 | 193.27,81.28 191.89,81.28 192.08,81.09 D5.A | 193.27,68.58 192.4,68.58 D6.A | D7.A 191.89,55.88 193.27,55.88 | D8.A 192.46,43.5 193.27,43.5 | 193.27,30.8 192.34,30.8 D9.A | 192.53,18.41 193.27,18.41 | 193.27,12.38 188.91,12.38 PAD1.1 | 193.27,12.38 193.27,11.75 193.27,7.22 192.08,6.03 D11.A
N$201
  pour Top (isolate 1.27): 193.55,-0.63 1.99,-0.01 0,1.99 0,133.87 2.01,135.87 193.57,135.25 195.56,133.25 195.56,1.37